# EAGLE design amr-breakout (EAGLE 7.7.0)
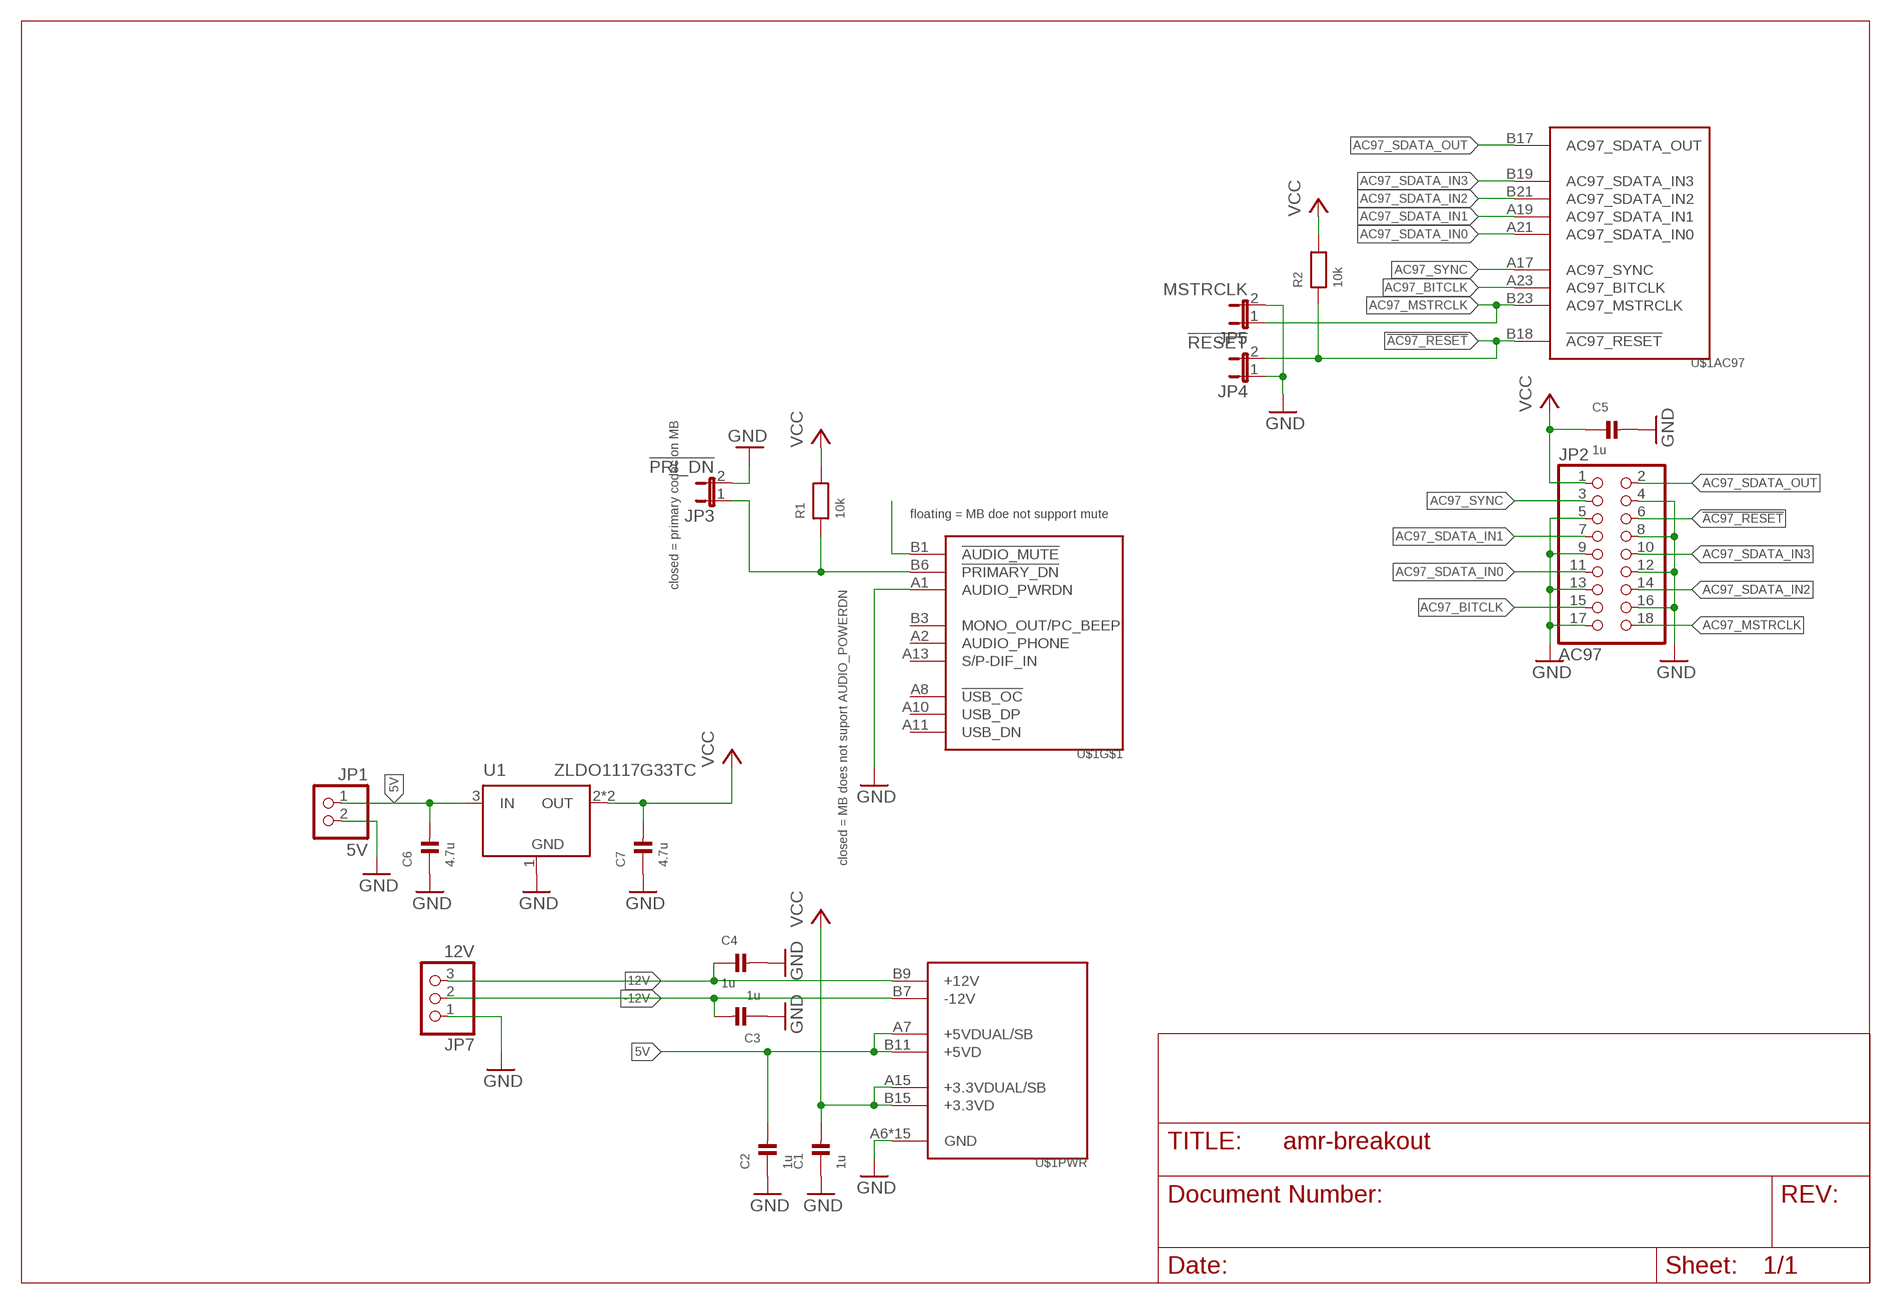
[diagram p0: schematic, sheet 1]

## Parts
C1  1u  CAP_CERAMIC_0603  [_0603]
C2  1u  CAP_CERAMIC_0603  [_0603]
C3  1u  CAP_CERAMIC_0603  [_0603]
C4  1u  CAP_CERAMIC_0603  [_0603]
C5  1u  CAP_CERAMIC_0603  [_0603]
C6  4.7u  CAP_CERAMIC_0805  [_0805]
C7  4.7u  CAP_CERAMIC_0805  [_0805]
JP1  5V  PINHD-1X2  [1X02]
JP2  AC97  PINHD-2X9  [2X09]
JP3  !PRI_DN  JP1E  [JP1]
JP4  !RESET  JP1E  [JP1]
JP5  MSTRCLK  JP1E  [JP1]
JP7  12V  PINHD-1X3  [1X03]
R1  10k  RESISTOR_0603  [_0603]
R2  10k  RESISTOR_0603  [_0603]
U1  ZLDO1117G33TC  LDO-TLV1117  [SOT223]
U$1  AMR-SLOT  [5650090-7]

## Nets
5V: C2.2 C6.2 JP1.1 U1.3(IN) U$1.A7(PWR:+5VDUAL/SB) U$1.B11(PWR:+5VD)
12V: C4.1 JP7.3 U$1.B9(PWR:+12V)
!AC97_RESET: JP2.6 JP4.2 R2.1 U$1.B18(AC97:!AC97_RESET)
!AUDIO_MUTE: U$1.B1(!AUDIO_MUTE)
!PRIMARY_DN: JP3.1 R1.1 U$1.B6(!PRIMARY_DN)
-12V: C3.2 JP7.2 U$1.B7(PWR:-12V)
AC97_BITCLK: JP2.15 U$1.A23(AC97:AC97_BITCLK)
AC97_MSTRCLK: JP2.18 JP5.1 U$1.B23(AC97:AC97_MSTRCLK)
AC97_SDATA_IN0: JP2.11 U$1.A21(AC97:AC97_SDATA_IN0)
AC97_SDATA_IN1: JP2.7 U$1.A19(AC97:AC97_SDATA_IN1)
AC97_SDATA_IN2: JP2.14 U$1.B21(AC97:AC97_SDATA_IN2)
AC97_SDATA_IN3: JP2.10 U$1.B19(AC97:AC97_SDATA_IN3)
AC97_SDATA_OUT: JP2.2 U$1.B17(AC97:AC97_SDATA_OUT)
AC97_SYNC: JP2.3 U$1.A17(AC97:AC97_SYNC)
GND: C1.1 C2.1 C3.1 C4.2 C5.2 C6.1 C7.1 JP1.2 JP2.4 JP2.5 JP2.8 JP2.9 JP2.12 JP2.13 JP2.16 JP2.17 JP3.2 JP4.1 JP5.2 JP7.1 U1.1(GND) U$1.A1(AUDIO_PWRDN) U$1.A6(PWR:GND) U$1.A9(PWR:GND) U$1.A12(PWR:GND) U$1.A14(PWR:GND) U$1.A16(PWR:GND) U$1.A18(PWR:GND) U$1.A20(PWR:GND) U$1.A22(PWR:GND) U$1.B2(PWR:GND) U$1.B8(PWR:GND) U$1.B10(PWR:GND) U$1.B12(PWR:GND) U$1.B16(PWR:GND) U$1.B20(PWR:GND) U$1.B22(PWR:GND)
VCC: C1.2 C5.1 C7.2 JP2.1 R1.2 R2.2 U1.2(OUT) U1.4(OUT) U$1.A15(PWR:+3.3VDUAL/SB) U$1.B15(PWR:+3.3VD)
Unconnected: U$1.A2(AUDIO_PHONE) U$1.A8(!USB_OC) U$1.A10(USB_DP) U$1.A11(USB_DN) U$1.A13(S/P-DIF_IN) U$1.B3(MONO_OUT/PC_BEEP)

## Notes on the sheet
- floating = MB doe not support mute
- closed = primary codec on MB | closed = MB does not suport AUDIO_POWERDN

## Library data of the parts
C1-C7 = rc-sysmocom:CAP_CERAMIC: Ceramic Capacitors 0402 - 0402 Surface Mount Capacitors 16pF 50V 5% [Digikey: 445-4899-2-ND] 18pF 50V 5% [Digikey: 490-1281-2-ND] 22pF 50V 5% [Digikey: 490-1283-2-ND] 68pF 50V 5% [Digikey: 490-1289-2-ND] 0.1uF 10V 10% [Digikey: 490-1318-2-ND] 1.0uF 6.3V 10% [Digikey: 490-1320-2-ND] 0603 - 0603 Surface Mount Capacitors 16 pF 50V 5% [Digikey: 445-5051-2-ND] 22 pF 50V [Digikey: PCC220ACVTR-ND] 33 pF 50V 5% [Digikey: 490-1415-1-ND] 56pF 50V 5% [Digikey: 490-1421-1-ND] 220pF 50V 5% [Digikey: 445-1285-1-ND] 680 pF 50V 2200 pF 50V 5% C0G [Digikey: 445-1297-1-ND] 5600 pF 100V 5% X7R [Digikey: 478-3711-1-ND] 0.1 µF 25V 10% [Digikey: PCC2277TR-ND] 0.22 µF 16V 10% X7R [Digikey: 445-1318-1-ND] 1.0 µF 25V 10% [Digikey: 445-5146-2-ND] 0603 - RF Specific 3pF 250V +/-0.1pF RF [Digikey: 712-1347-1-ND] 18 pF 250V 5% [Digikey: 478-3505-1-ND or 712-1322-1-ND] 56 pF 250V 5% C0G RF [Digikey: 490-4867-1-ND] 68 pF 250V RF [Digikey: 490-4868-1-ND] 0805 - 0805 Surface Mount Capacitors 220 pF 250V 2% RF Ceramic Capacitor [Digikey: 712-1398-1-ND] 1000 pF 50V 2% NP0 Ceramic Capacitor [Digikey: 478-3760-1-ND] 0.1 µF 25V 10% Ceramic Capacitor [Digikey: PCC1828TR-ND] 1.0 µF 16V 10% Ceramic Capacitor[Digikey: 490-1691-2-ND] 10.0 µF 10V 10% Ceramic Capacitor[Digikey: 709-1228-1-ND] 10.0 uF 16V 10% Ceramic Capacitor [Digikey: 478-5165-2-ND] 47 uF 6.3V 20% Ceramic Capacitor [Digikey: 587-1779-1-ND or 399-5506-1-ND] 1206 - 1206 Surface Mount Capacitors 47uF 10V 20% Ceramic Capacitor [Digikey: 490-5528-1-ND or 399-5508-1-ND or 445-6010-1-ND] 100uF 6.3V -20%, +80% Y5V Ceramic Capacitor (Digikey: 490-4512-1-ND, Mouser: 81-GRM31CF50J107ZE1L) 1810 - 1810 Surface Mount Capacitors High volt MLC; no solder stop between for higher isolation
JP1 = pinhead:PINHD-1X2: PIN HEADER
JP2 = pinhead:PINHD-2X9: PIN HEADER
JP3-JP5 = jumper:JP1E: JUMPER
JP7 = pinhead:PINHD-1X3: PIN HEADER
R1 R2 = rc-sysmocom:RESISTOR: Resistors 0402 - 0402 Surface Mount Package 22 Ohm 1% 1/16W [Digikey: 311-22.0LRTR-ND] 33 Ohm 5% 1/16W 1.0K 5% 1/16W 1.5K 5% 1/16W 2.0K 1% 1/16W 10.0K 1% 1/16W [Digikey: 311-10.0KLRTR-ND] 10.0K 5% 1/16W [Digikey: RMCF0402JT10K0TR-ND] 12.1K 1% 1/16W [Digikey: 311-22.0LRTR-ND] 100.0K 5% 1/16W 0603 - 0603 Surface Mount Package 1/10 Watt 0805 - 0805 Surface Mount Package 1/8 Watt 1206 - 1206 Surface Mount Package 2012 - 2010 Surface Mount Package 0.11 Ohm 1/2 Watt 1% Resistor - Digikey: RHM.11UCT-ND
U1 = ldo:LDO
U$1 = audio-modem-riser:AMR-SLOT

## Board
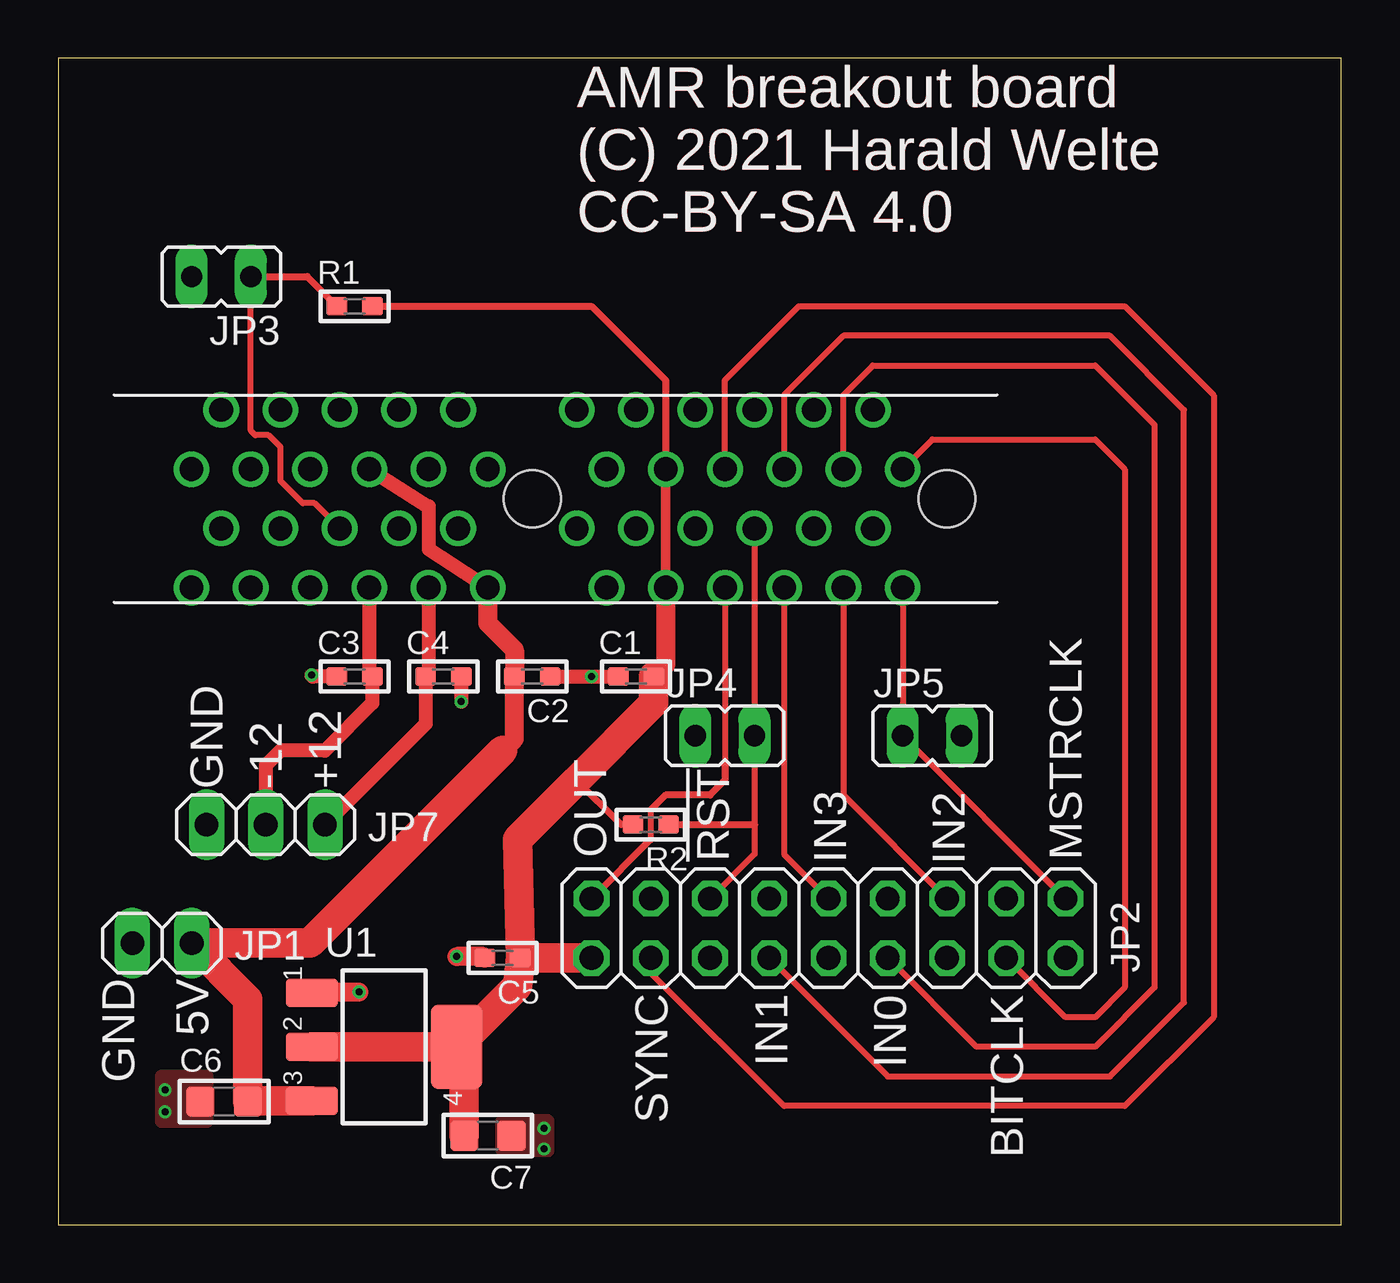
[diagram p1: board, top side]
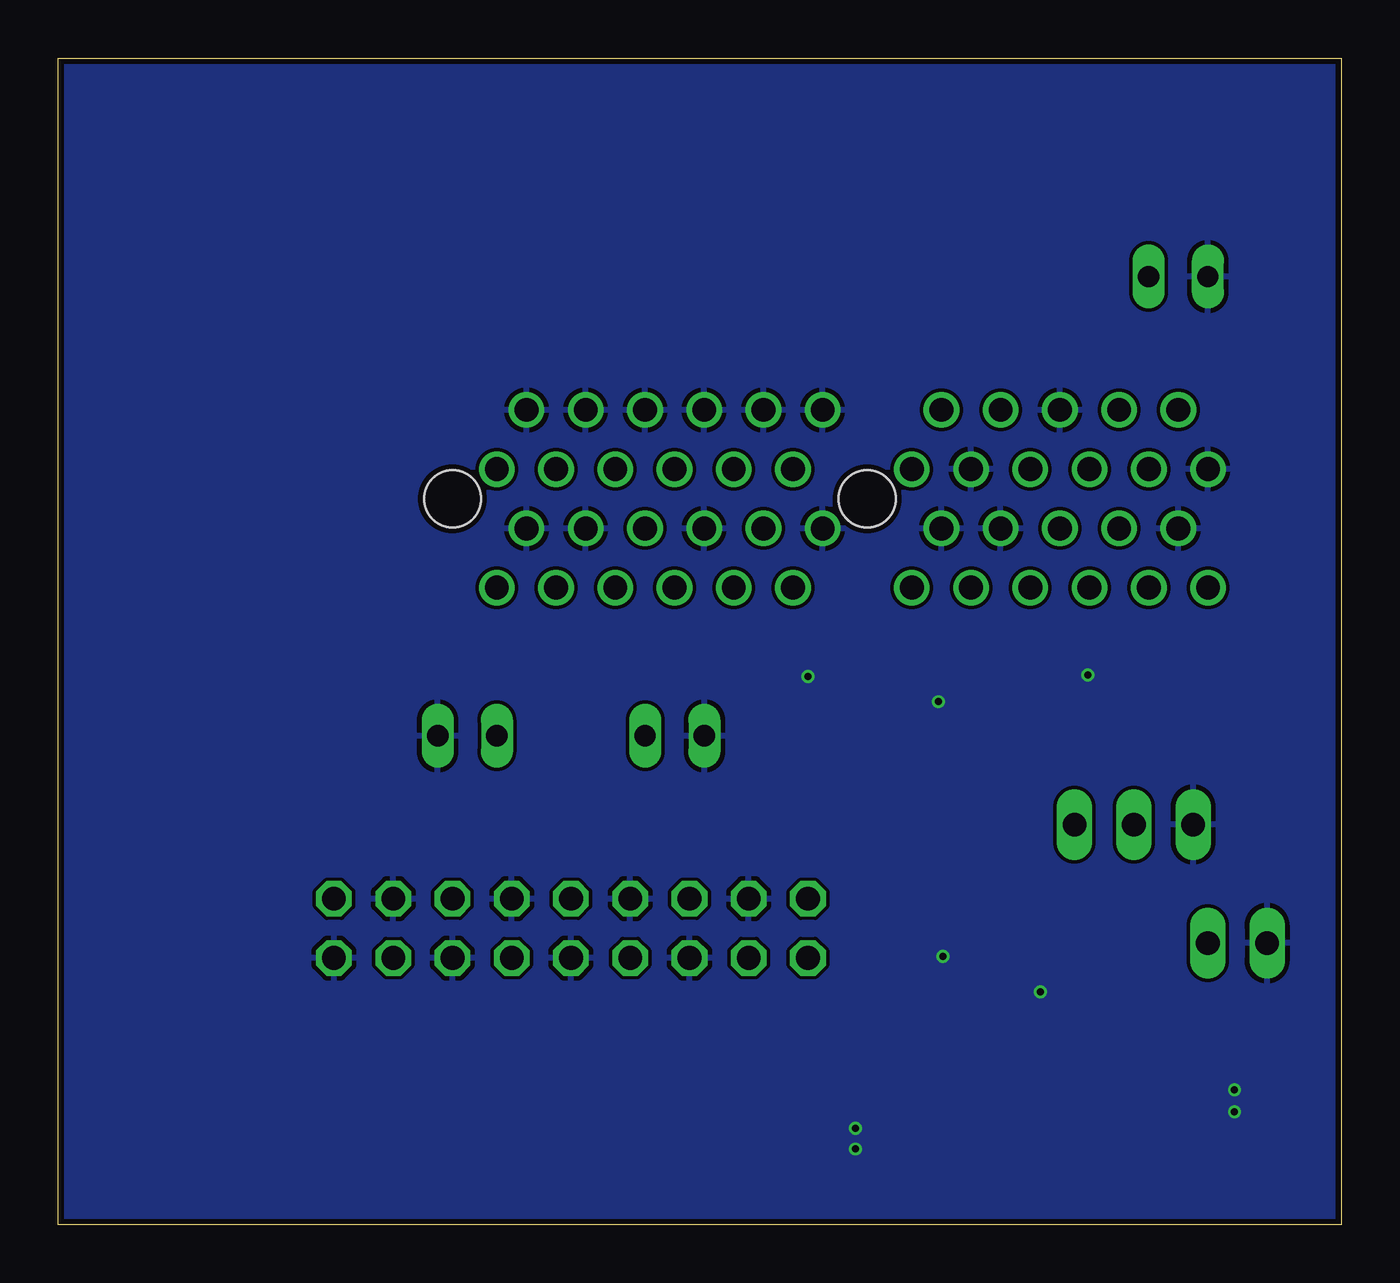
[diagram p2: board, bottom side, seen from below]

Size 55 x 50 mm. Coordinates in mm from the lower left corner, seen from the top.
Outline: 0,0 55,0 55,50 0,50 0,0
Copper layers (1*16): Top 0.018mm / dielectric 1.55mm / Bottom 0.018mm
Design rules "eC_2Layer_PClass6_BaseCopperO18_eCDefault": minimum track width 0.15mm, minimum drill 0.35mm, track to track 0.15mm, track to pad 0.15mm, pad to pad 0.15mm, via to via 0.15mm, smd to smd 0mil, copper to edge 0.25mm, drill to drill 0.35mm, minimum pad ring 0.175mm, minimum via ring 0.125mm, stop-mask expansion 0mil, vias tented up to drill 0.45mm, thermal gap 0.2mm

### Footprints (pad centres in the part's own frame; a part is rotated, then mirrored left to right if it is on the bottom)
_0603 = smd 0.9 x 0.8: 1 -0.762,0; 2 0.762,0
_0805 = smd 1.2 x 1.3: 1 -1.016,0; 2 1.016,0
1X02 = drill 1.016 long: 1 -1.27,0; 2 1.27,0
2X09 = drill 1.016 octagon: 1 -10.16,-1.27; 2 -10.16,1.27; 3 -7.62,-1.27; 4 -7.62,1.27; 5 -5.08,-1.27; 6 -5.08,1.27; 7 -2.54,-1.27; 8 -2.54,1.27; 9 0,-1.27; 10 0,1.27; 11 2.54,-1.27; 12 2.54,1.27; 13 5.08,-1.27; 14 5.08,1.27; 15 7.62,-1.27; 16 7.62,1.27; 17 10.16,-1.27; 18 10.16,1.27
JP1 = drill 0.914 long: 1 0,-1.27; 2 0,1.27
1X03 = drill 1.016 long: 1 -2.54,0; 2 0,0; 3 2.54,0
SOT223 = smd 1.219 x 2.235: 1 -2.311,-3.099; 2 0,-3.099; 3 2.311,-3.099 | smd 3.6 x 2.2: 4 0,3.099
5650090-7 = drill 1.02: A1 -14.61,1.27; A2 -13.34,3.81; A3 -12.07,1.27; A4 -10.8,3.81; A5 -9.53,1.27; A6 -8.26,3.81; A7 -6.99,1.27; A8 -5.72,3.81; A9 -4.45,1.27; A10 -3.18,3.81; A11 -1.91,1.27; A12 1.91,3.81; A13 3.18,1.27; A14 4.45,3.81; A15 5.72,1.27; A16 6.99,3.81; A17 8.26,1.27; A18 9.53,3.81; A19 10.8,1.27; A20 12.07,3.81; A21 13.34,1.27; A22 14.61,3.81; A23 15.88,1.27; B1 -14.61,-3.81; B2 -13.34,-1.27; B3 -12.07,-3.81; B4 -10.8,-1.27; B5 -9.53,-3.81; B6 -8.26,-1.27; B7 -6.99,-3.81; B8 -5.72,-1.27; B9 -4.45,-3.81; B10 -3.18,-1.27; B11 -1.91,-3.81; B12 1.91,-1.27; B13 3.18,-3.81; B14 4.45,-1.27; B15 5.72,-3.81; B16 6.99,-1.27; B17 8.26,-3.81; B18 9.53,-1.27; B19 10.8,-3.81; B20 12.07,-1.27; B21 13.34,-3.81; B22 14.61,-1.27; B23 15.88,-3.81 | hole 2.44: 0,0; 17.78,0

### Placement (x,y rotation side)
C1  24.77,23.5 0 top
C2  20.32,23.5 180 top
C3  12.7,23.5 0 top
C4  16.51,23.5 0 top
C5  19.05,11.43 180 top
C6  7.11,5.27 0 top
C7  18.41,3.81 180 top
JP1  4.45,12.06 180 top
JP2  33.02,12.7 0 top
JP3  6.99,40.64 90 top
JP4  28.57,20.95 270 top
JP5  37.47,20.95 270 top
JP7  8.89,17.14 0 top
R1  12.7,39.37 0 top
R2  25.4,17.14 180 top
U1  13.97,7.62 270 top
U$1  20.32,31.11 0 top

### Tracks (layer width: path | path; a pad name or v marks a point on that pad's centre or on a via)
5V
  Top 0.61: U$1.A7 15.81,30.8 15.88,30.8 15.88,28.96 U$1.B11
  Top 0.813: U$1.B11 18.41,25.79 19.56,24.64 C2.2 19.56,20.83 19.05,20.32
  Top 1.27: U1.3 8.17,5.31 C6.2 8.13,9.65 JP1.1 10.79,12.06 19.05,20.32
12V
  Top 0.61: U$1.B9 15.87,23.62 C4.1 15.75,21.46 JP7.3
!AC97_RESET
  Top 0.15: JP4.2 29.85,20.32
  Top 0.254: U$1.B18 29.85,20.32 29.85,17.14 29.85,15.88 JP2.6
  Top 0.305: R2.1 29.85,17.14
!PRIMARY_DN
  Top 0.254: U$1.B6 10.98,30.92 10.48,30.92 9.53,31.88 9.53,33.34 9.02,33.85 8.45,33.85 8.26,34.04 JP3.1
  Top 0.305: JP3.1 10.67,40.64 R1.1
-12V
  Top 0.61: U$1.B7 13.33,23.63 C3.2 13.46,22.35 11.43,20.32 9.53,20.32 8.89,19.68 JP7.2
AC97_BITCLK
  Top 0.254: U$1.A23 37.47,33.66 44.45,33.66 45.72,32.38 45.72,10.16 44.45,8.89 43.18,8.89 JP2.15
AC97_MSTRCLK
  Top 0.15: JP5.1
  Top 0.254: U$1.B23 JP5.1 JP2.18
AC97_SDATA_IN0
  Top 0.254: U$1.A21 33.66,35.56 34.92,36.83 44.45,36.83 46.99,34.29 46.99,10.16 44.45,7.62 39.37,7.62 JP2.11
AC97_SDATA_IN1
  Top 0.254: JP2.7 35.56,6.35 45.09,6.35 48.26,9.53 48.26,34.92 45.09,38.1 33.66,38.1 31.12,35.56 U$1.A19
AC97_SDATA_IN2
  Top 0.254: U$1.B21 33.66,18.41 JP2.14
AC97_SDATA_IN3
  Top 0.254: U$1.B19 31.12,15.87 JP2.10
AC97_SDATA_OUT
  Top 0.25: 25.4,17.78 25.4,16.51
  Top 0.254: U$1.B17 28.58,19.69
  Top 0.305: 28.58,19.69 28.58,19.05 27.94,18.41 26.04,18.41 25.4,17.78 | 25.4,16.51 JP2.2
AC97_SYNC
  Top 0.254: U$1.A17 28.57,36.2 31.75,39.37 45.72,39.37 49.53,35.56 49.53,8.89 45.72,5.08 31.11,5.08 25.4,10.79 JP2.3
GND  (via drill 0.3)
  Top 0.61: C1.1 v22.86,23.5 C2.1 | C3.1 10.92,23.5 v10.86,23.56 | C4.2 v17.27,22.42
  Top 0.813: U1.1 10.91,9.97 v12.89,9.97 | C5.2 18.22,11.49 v17.08,11.49
  other vias: 4.57,5.78 4.57,4.83 20.83,4.13 20.83,3.24
  pour Bottom: 0,50.16 55,50.16 55,0 0,0
  pour Top (no thermals): 4.45,6.35 6.35,6.35 6.35,4.45 4.45,4.45
  pour Top (no thermals): 19.05,4.45 20.95,4.45 20.95,3.17 19.05,3.17
VCC
  Top 0.305: R1.2 22.86,39.37 26.04,36.2 U$1.A15 | R2.2 24.13,17.14 22.23,19.05
  Top 0.406: U$1.B15 U$1.A15
  Top 0.813: U$1.B15 26.04,24.01 C1.2
  Top 1.27: U1.4 17.4,7.29 C7.2 | U1.4 19.68,10.24 C5.1 | C5.1 JP2.1 | C1.2 25.53,22.35 22.23,19.05 19.68,16.51 C5.1 | U1.2 U1.4

### Text on the board
Top: AMR breakout board / (C) 2021 Harald Welte / CC-BY-SA 4.0
tNames: AMR breakout board / (C) 2021 Harald Welte / CC-BY-SA 4.0 | GND | -12 | +12 | OUT | !RST | MSTRCLK | IN3 | IN2 | GND | 5V | SYNC | IN1 | IN0 | BITCLK